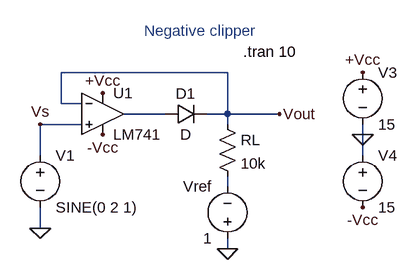
[diagram p0: schematic Negative clipper.asc]
Negative clipper.asc, the LTspice schematic file:
Version 4
SHEET 1 880 680
WIRE 496 64 240 64
WIRE 240 112 240 64
WIRE 272 112 240 112
WIRE 400 128 336 128
WIRE 496 128 496 64
WIRE 496 128 464 128
WIRE 576 128 496 128
WIRE 272 144 208 144
WIRE 496 144 496 128
WIRE 704 160 704 144
WIRE 208 192 208 144
WIRE 704 192 704 160
WIRE 496 240 496 224
WIRE 208 304 208 272
WIRE 496 336 496 320
FLAG 208 304 0
FLAG 496 336 0
FLAG 576 128 Vout
FLAG 208 144 Vs
FLAG 704 160 0
FLAG 704 64 +Vcc
FLAG 304 96 +Vcc
FLAG 704 272 -Vcc
FLAG 304 160 -Vcc
SYMBOL voltage 208 176 R0
WINDOW 39 0 0 Left 2
SYMATTR InstName V1
SYMATTR Value SINE(0 2 1)
SYMATTR Value2 AC 2 0
SYMBOL Opamps\\LM741 304 64 R0
SYMATTR InstName U1
SYMBOL res 480 128 R0
SYMATTR InstName RL
SYMATTR Value 10k
SYMBOL voltage 704 48 R0
SYMATTR InstName V3
SYMATTR Value 15
SYMBOL voltage 704 176 R0
SYMATTR InstName V4
SYMATTR Value 15
SYMBOL diode 400 144 R270
WINDOW 0 32 32 VTop 2
WINDOW 3 0 32 VBottom 2
SYMATTR InstName D1
SYMBOL voltage 496 336 R180
WINDOW 0 24 96 Left 2
WINDOW 3 24 16 Left 2
SYMATTR InstName Vref
SYMATTR Value 1
TEXT 520 32 Left 2 !.tran 10
TEXT 368 0 Left 2 ;Negative clipper

The netlist it stands for:
* Negative clipper.asc
V1 Vs 0 SINE(0 2 1) AC 2 0
XU1 Vs Vout +Vcc -Vcc N001 LM741  ; pins In+ In- V+ V- OUT
RL Vout N002 10k
V3 +Vcc 0 15
V4 0 -Vcc 15
D1 N001 Vout D
Vref 0 N002 1
.model D D
.lib standard.dio
.tran 10
* Negative clipper
.lib LM741.lib
.backanno
.end